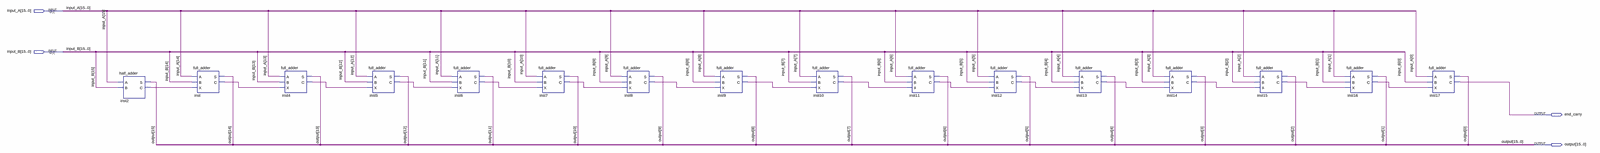
[diagram p0: schematic sheet, whole]
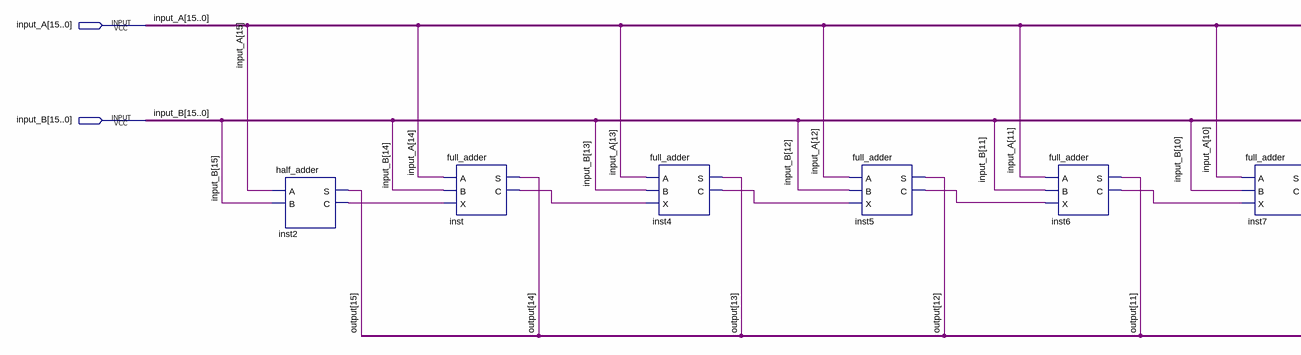
[diagram p1: schematic sheet, left part]
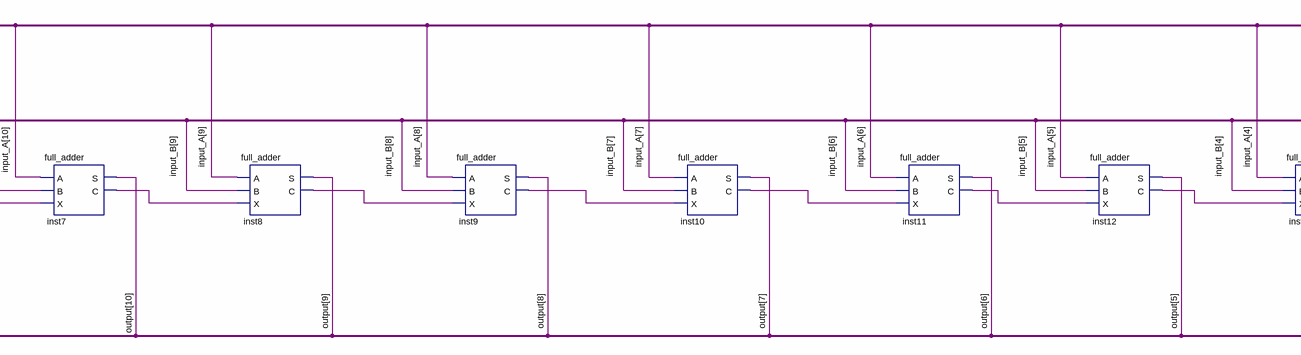
[diagram p2: schematic sheet, centre part]
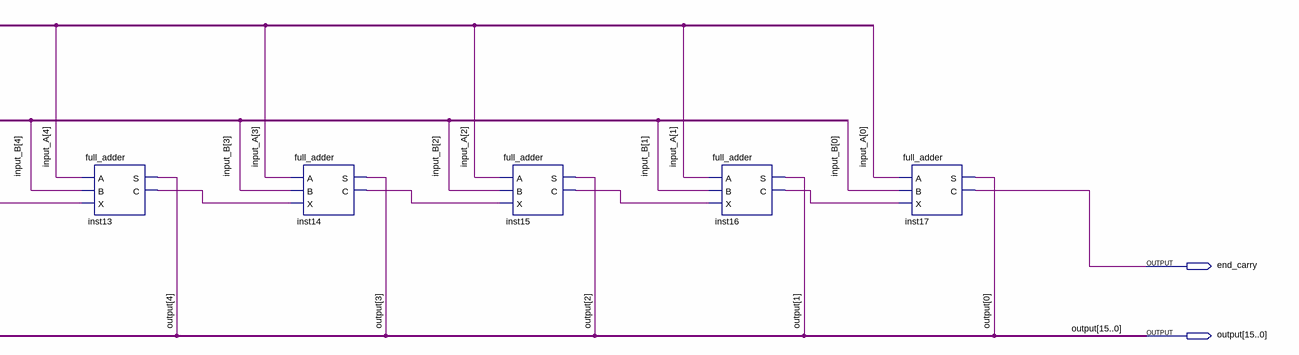
[diagram p3: schematic sheet, right part]
// Quartus schematic 16adder.bdf as structural Verilog: 16 symbols, 4 pins
module \16adder  (
  input  [15:0] input_A,
  input  [15:0] input_B,
  output end_carry,
  output [15:0] \output 
);

  wire inst2_c, inst4_c, inst5_c, inst6_c, inst7_c, inst8_c, inst9_c, inst10_c, inst11_c, inst12_c, inst13_c,
       inst14_c, inst15_c, inst16_c, inst_c;

  half_adder inst2 (.A(input_A[15]), .B(input_B[15]), .S(\output [15]), .C(inst2_c));
  full_adder inst (.A(input_A[14]), .B(input_B[14]), .X(inst2_c), .S(\output [14]), .C(inst_c));
  full_adder inst4 (.A(input_A[13]), .B(input_B[13]), .X(inst_c), .S(\output [13]), .C(inst4_c));
  full_adder inst5 (.A(input_A[12]), .B(input_B[12]), .X(inst4_c), .S(\output [12]), .C(inst5_c));
  full_adder inst6 (.A(input_A[11]), .B(input_B[11]), .X(inst5_c), .S(\output [11]), .C(inst6_c));
  full_adder inst7 (.A(input_A[10]), .B(input_B[10]), .X(inst6_c), .S(\output [10]), .C(inst7_c));
  full_adder inst8 (.A(input_A[9]), .B(input_B[9]), .X(inst7_c), .S(\output [9]), .C(inst8_c));
  full_adder inst9 (.A(input_A[8]), .B(input_B[8]), .X(inst8_c), .S(\output [8]), .C(inst9_c));
  full_adder inst10 (.A(input_A[7]), .B(input_B[7]), .X(inst9_c), .S(\output [7]), .C(inst10_c));
  full_adder inst11 (.A(input_A[6]), .B(input_B[6]), .X(inst10_c), .S(\output [6]), .C(inst11_c));
  full_adder inst12 (.A(input_A[5]), .B(input_B[5]), .X(inst11_c), .S(\output [5]), .C(inst12_c));
  full_adder inst13 (.A(input_A[4]), .B(input_B[4]), .X(inst12_c), .S(\output [4]), .C(inst13_c));
  full_adder inst14 (.A(input_A[3]), .B(input_B[3]), .X(inst13_c), .S(\output [3]), .C(inst14_c));
  full_adder inst15 (.A(input_A[2]), .B(input_B[2]), .X(inst14_c), .S(\output [2]), .C(inst15_c));
  full_adder inst16 (.A(input_A[1]), .B(input_B[1]), .X(inst15_c), .S(\output [1]), .C(inst16_c));
  full_adder inst17 (.A(input_A[0]), .B(input_B[0]), .X(inst16_c), .S(\output [0]), .C(end_carry));
endmodule
